# Altium schematic sheet Reset_Block.SchDoc
size A; SheetNumber: 9; SheetTotal: 9
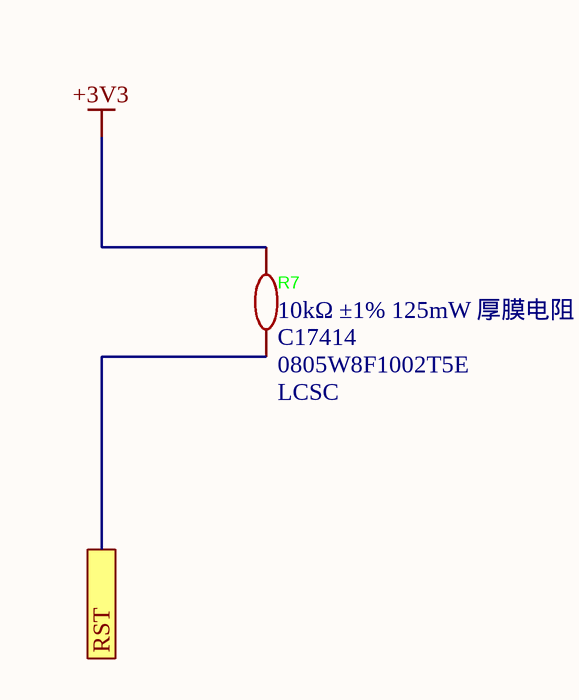
[diagram p0: Reset_Block.SchDoc]

## Parts
R7  LCSC Part Name: 10kΩ ±1% 125mW 厚膜电阻  Supplier Part: C17414  Supplier: LCSC  [R0805]  (hidden comment: 10kΩ)

## Ports
RST

## Nets
+3V3: R7.2
RST: R7.1 ; port RST

## Library data of the parts
R7 = 0805W8F1002T5E: Manufacturer: UNI-ROYAL(厚声); Add into BOM: yes; Tolerance: ±1%; Power(Watts): 125mW; Voltage-Supply(Max): 150V; Temperature Coefficient: ±100ppm/℃; Symbol: 0805W8F1002T5E; Device: 0805W8F1002T5E; Value: 10kΩ; Supplier Footprint: 0805; JLCPCB Part Class: Basic Part; Datasheet: https://item.szlcsc.com/datasheet/0805W8F1002T5E/18102.html; Convert to PCB: yes; Type: Thick Film Resistor; Operating Temperature: -55℃~+155℃; Manufacturer Part: 0805W8F1002T5E